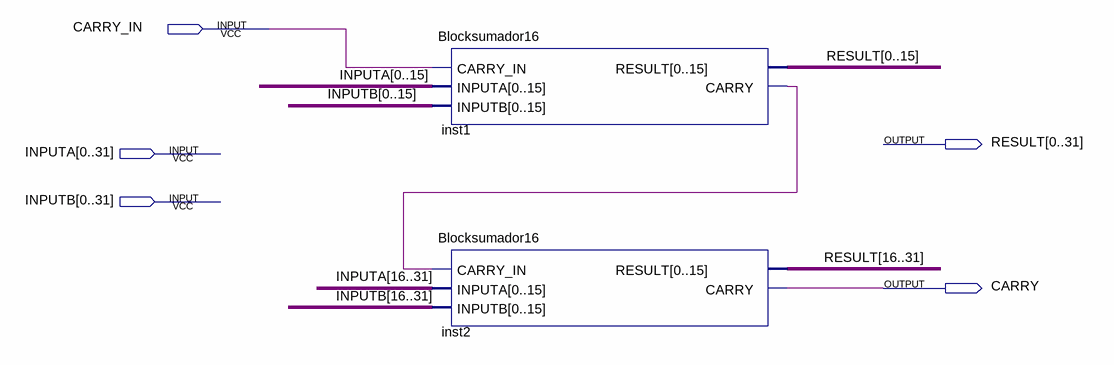
[diagram p0: schematic sheet]
// Quartus schematic Blocksumador32.bdf as structural Verilog: 2 symbols, 5 pins
module Blocksumador32 (
  input  CARRY_IN,
  input  [0:31] INPUTA,
  input  [0:31] INPUTB,
  output [0:31] RESULT,
  output CARRY
);

  wire inst1_carry;

  Blocksumador16 inst1 (
    .CARRY_IN(CARRY_IN), .INPUTA(INPUTA[0:15]), .INPUTB(INPUTB[0:15]), .RESULT(RESULT[0:15]),
    .CARRY(inst1_carry));
  Blocksumador16 inst2 (
    .CARRY_IN(inst1_carry), .INPUTA(INPUTA[16:31]), .INPUTB(INPUTB[16:31]), .RESULT(RESULT[16:31]),
    .CARRY(CARRY));
endmodule
